# Altium schematic sheet power_supply.SchDoc
size A4
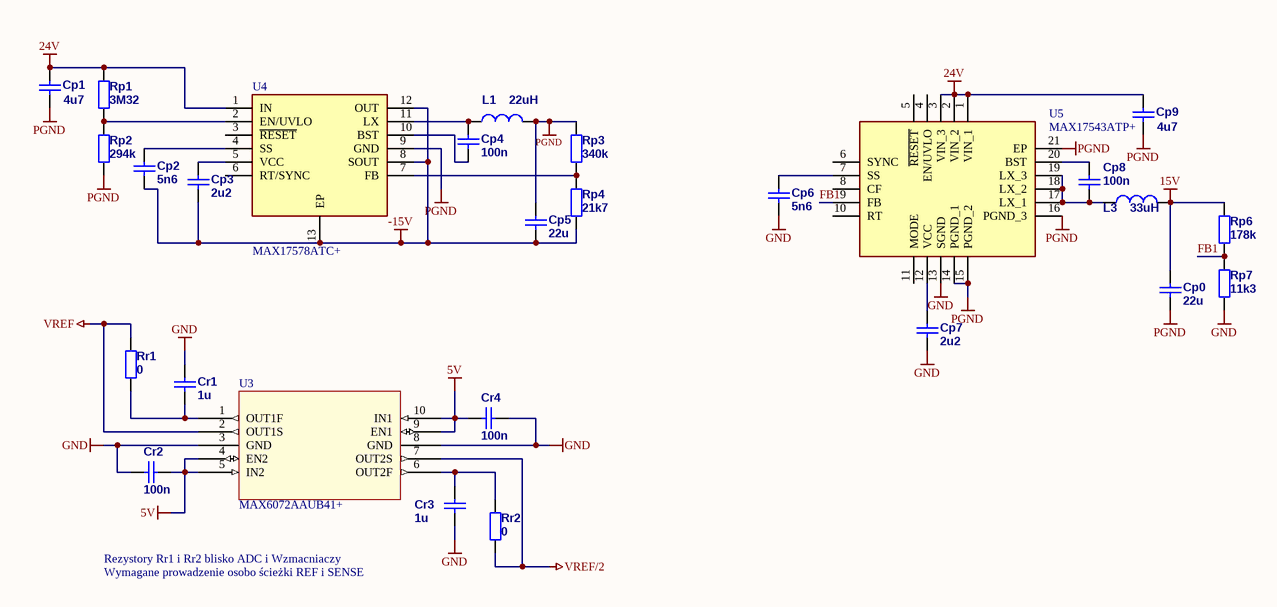
[diagram p0: power_supply.SchDoc]

## Parts
Cp0  22u  [C1206]
Cp1  4u7  [C1206]
Cp2  5n6  [C0603]
Cp3  2u2  [C0603]
Cp4  100n  [C0603]
Cp5  22u  [C1206]
Cp6  5n6  [C0603]
Cp7  2u2  [C0603]
Cp8  100n  [C0603]
Cp9  4u7  [C1206]
Cr1  1u  [C1206]
Cr2  100n  [C0805]
Cr3  1u  [C1206]
Cr4  100n  [C0805]
L1  22uH  [DE1205]
L3  33uH  [DE1205]
Rp1  3M32  [R0603]
Rp2  294k  [R0603]
Rp3  340k  [R0603]
Rp4  21k7  [R0603]
Rp6  178k  [R0603]
Rp7  11k3  [R0603]
Rr1  0  [R0402]
Rr2  0  [R0402]
U3  MAX6072AAUB41+  [21-0061L_MXM]
U4  MAX17578ATC+  [SON50P300X300X80-13N]
U5  MAX17543ATP+  [QFN50P400X400X80-21N]

## Nets
5V: Cr2.1 Cr4.2 U3.4(EN2) U3.5(IN2) U3.9(EN1) U3.10(IN1)
15V: Cp0.2 L3.2 Rp6.2
24V: Cp1.2 Cp9.2 Rp1.2 U4.1(IN) U5.1(VIN_1) U5.2(VIN_2) U5.3(VIN_3)
-15V: Cp2.1 Cp3.1 Cp5.1 Rp4.1 U4.8(SOUT) U4.12(OUT) U4.13(EP)
GND: Cp6.1 Cp7.1 Cr1.2 Cr2.2 Cr3.1 Cr4.1 Rp7.1 U3.3(GND) U3.8(GND) U5.13(SGND)
PGND: Cp0.1 Cp1.1 Cp5.2 Cp9.1 L1.2 Rp2.1 Rp3.2 U4.9(GND) U5.14(PGND_1) U5.15(PGND_2) U5.16(PGND_3) U5.21(EP)
VREF: Rr1.2 U3.2(OUT1S)
VREF/2: Rr2.1 U3.7(OUT2S)
FB1: Rp6.1 Rp7.2 U5.9(FB)
NetCp2_2: Cp2.2 U4.4(SS)
NetCp3_2: Cp3.2 U4.5(VCC)
NetCp4_1: Cp4.1 L1.1 U4.11(LX)
NetCp4_2: Cp4.2 U4.10(BST)
NetCp6_2: Cp6.2 U5.7(SS)
NetCp7_2: Cp7.2 U5.12(VCC)
NetCp8_1: Cp8.1 L3.1 U5.17(LX_1) U5.18(LX_2) U5.19(LX_3)
NetCp8_2: Cp8.2 U5.20(BST)
NetCr1_1: Cr1.1 Rr1.1 U3.1(OUT1F)
NetCr3_2: Cr3.2 Rr2.2 U3.6(OUT2F)
NetRp1_1: Rp1.1 Rp2.2 U4.2(EN/UVLO)
NetRp3_1: Rp3.1 Rp4.2 U4.7(FB)

Not connected (* = marked no-connect by the designer): U4 3(~{RESET}) 6(RT/SYNC); U5 4(EN/UVLO) 5(~{RESET}) 6(SYNC) 8(CF) 10(RT) 11(MODE)

## Notes on the sheet
- Rezystory Rr1 i Rr2 blisko ADC i Wzmacniaczy
- Wymagane prowadzenie osobo ścieżki REF i SENSE

## Library data of the parts
Cp0-Cp9 Cr1-Cr4 = Cap: Capacitor; ComponentLink1Description: datasheet; ComponentLink2Description: supplier
  Cp0 Cp5: Value: 22u
  Cp1 Cp9: Value: 4u7
  Cp2 Cp6: Value: 5n6
  Cp3 Cp7: Value: 2u2
  Cp4 Cp8 Cr2 Cr4: Value: 100n
  Cr1 Cr3: Value: 1u
L1 L3 = DE1205-22: Published: 08-Mar-2006; ComponentLink1Description: datasheet; ComponentLink2Description: supplier; Supplier 1: TME; Supplier Part Number 1: DE1205-22
  L1: Value: 22uH
  L3: Value: 33uH
Rp1-Rp4 Rp6 Rp7 Rr1 Rr2 = Res: Resistor; Published: 19-Feb-2006; ComponentLink1Description: datasheet; ComponentLink2Description: supplier
  Rp1: Value: 3M32
  Rp2: Value: 294k
  Rp3: Value: 340k
  Rp4: Value: 21k7
  Rp6: Value: 178k
  Rp7: Value: 11k3
  Rr1 Rr2: Value: 0
U3 = MAX6072AAUB41+: High-Precision, Dual-Output Series / Voltage Reference; Mfr_Name: Maxim Integrated Products; Manufacturer_Part_Number: MAX6072AAUB25+; Copyright: Copyright (C) 2022 Ultra Librarian. All rights reserved.; RefDes: RefDes; Type: DEV
U4 = MAX17578ATC+: Integrated Circuit; Manufacturer_Name: Maxim Integrated; Datasheet Link: https://datasheets.maximintegrated.com/en/ds/MAX17577-MAX17578.pdf; Height: 0.8mm; Manufacturer_Part_Number: MAX17578ATC+
U5 = MAX17543ATP+: Integrated Circuit; Manufacturer_Name: Maxim Integrated; Datasheet Link: https://pdfserv.maximintegrated.com/en/ds/MAX17543.pdf; Height: 0.8mm; Manufacturer_Part_Number: MAX17543ATP+